# Altium schematic sheet SATA_GiGE.SchDoc
size A
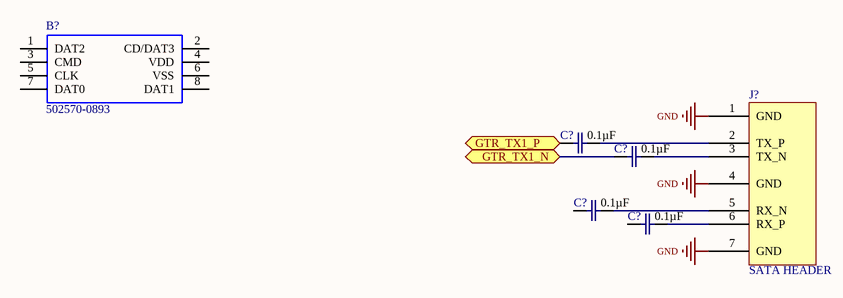
[diagram p0: SATA_GiGE.SchDoc]

## Parts
(Parts that share a designator on the sheet are numbered #1, #2 ... from top to bottom, then left to right.)
B?  502570-0893  [502570-0893_1]
C?#1  value 0.1µF  [CAP_0603]  (hidden comment: C0603X5R1E104K030BB)
C?#2  value 0.1µF  [CAP_0603]  (hidden comment: C0603X5R1E104K030BB)
C?#3  value 0.1µF  [CAP_0603]  (hidden comment: C0603X5R1E104K030BB)
C?#4  value 0.1µF  [CAP_0603]  (hidden comment: C0603X5R1E104K030BB)
J?  SATA HEADER  [SATA HEADER]

## Ports
GTR_TX1_N, GTR_TX1_P

## Nets
GND: J?.1(GND) J?.4(GND) J?.7(GND)
GTR_TX1_N: C?#2.1 ; port GTR_TX1_N
GTR_TX1_P: C?#1.1 ; port GTR_TX1_P
NetC?#1_2: C?#1.2 J?.2(TX_P)
NetC?#2_2: C?#2.2 J?.3(TX_N)
NetC?#3_2: C?#3.2 J?.5(RX_N)
NetC?#4_2: C?#4.2 J?.6(RX_P)

Not connected (* = marked no-connect by the designer): B? 1(DAT2) 2(CD/DAT3) 3(CMD) 4(VDD) 5(CLK) 6(VSS) 7(DAT0) 8(DAT1); C?#3 1; C?#4 1

## Library data of the parts
B? = SD 502570-0893: Micro SD card connector,SMT,push-push Micro SD card connector,SMT,push-push; Manufacturer_Name: Molex; Geometry.Height: mm; Detailed Description: 10 (8 + 2) Position Card Connector Secure Digital - microSD™ Surface Mount, Right Angle Gold; Card Type: Secure Digital - microSD™; Number of Positions: 10 (8 + 2); Connector Type: Connector and Ejector; Insertion, Removal Method: Push In, Push Out; Manufacturer_Part_Number: 502570-0893; Datasheet Link: http://www.molex.com/molex/products/datasheet.jsp?part=active/5025700893_MEMORY_CARD_SOCKET.xml; Digi-Key Part Number: WM19093CT-ND; Series: 502570; Mounting Type: Surface Mount, Right Angle; Features: Switch; Height Above Board: 0.071" (1.80mm); Mounting Feature: Normal, Standard - Top; Contact Finish: Gold; Contact Finish Thickness: 20µin (0.51µm)
C?#1-C?#4 = C0603X5R1E104K030BB: CAP CER 0.1UF 25V 10% X5R 0201; Manufacturer: TDK Corporation; Detailed Description: 0.1µF ±10% 25V Ceramic Capacitor X5R 0201 (0603 Metric); Manufacturer_Part_Number: C0603X5R1E104K030BB; Digi-Key Part Number: 445-13671-1-ND; Tolerance: ±10%; Voltage - Rated: 25V; Temperature Coefficient: X5R; Operating Temperature: -55°C ~ 85°C; Features: Low ESL; Applications: General Purpose; Mounting Type: Surface Mount, MLCC
J? = SATA HEADER: CONN HEADER 7POS VERT SMD 15GOLD; Manufacturer: Molex, LLC; Manufacturer Part Number: 0678005005; Connector Style: Header, Shrouded; Number of Positions: 7; Digi-Key Part Number: WM19104-ND; Series: 67800; Part Status: Active; Connector Type: SATA; Mounting Type: Surface Mount; Termination: Solder; Features: Board Guide; Contact Finish: Gold; Contact Finish Thickness: 15µin (0.38µm)